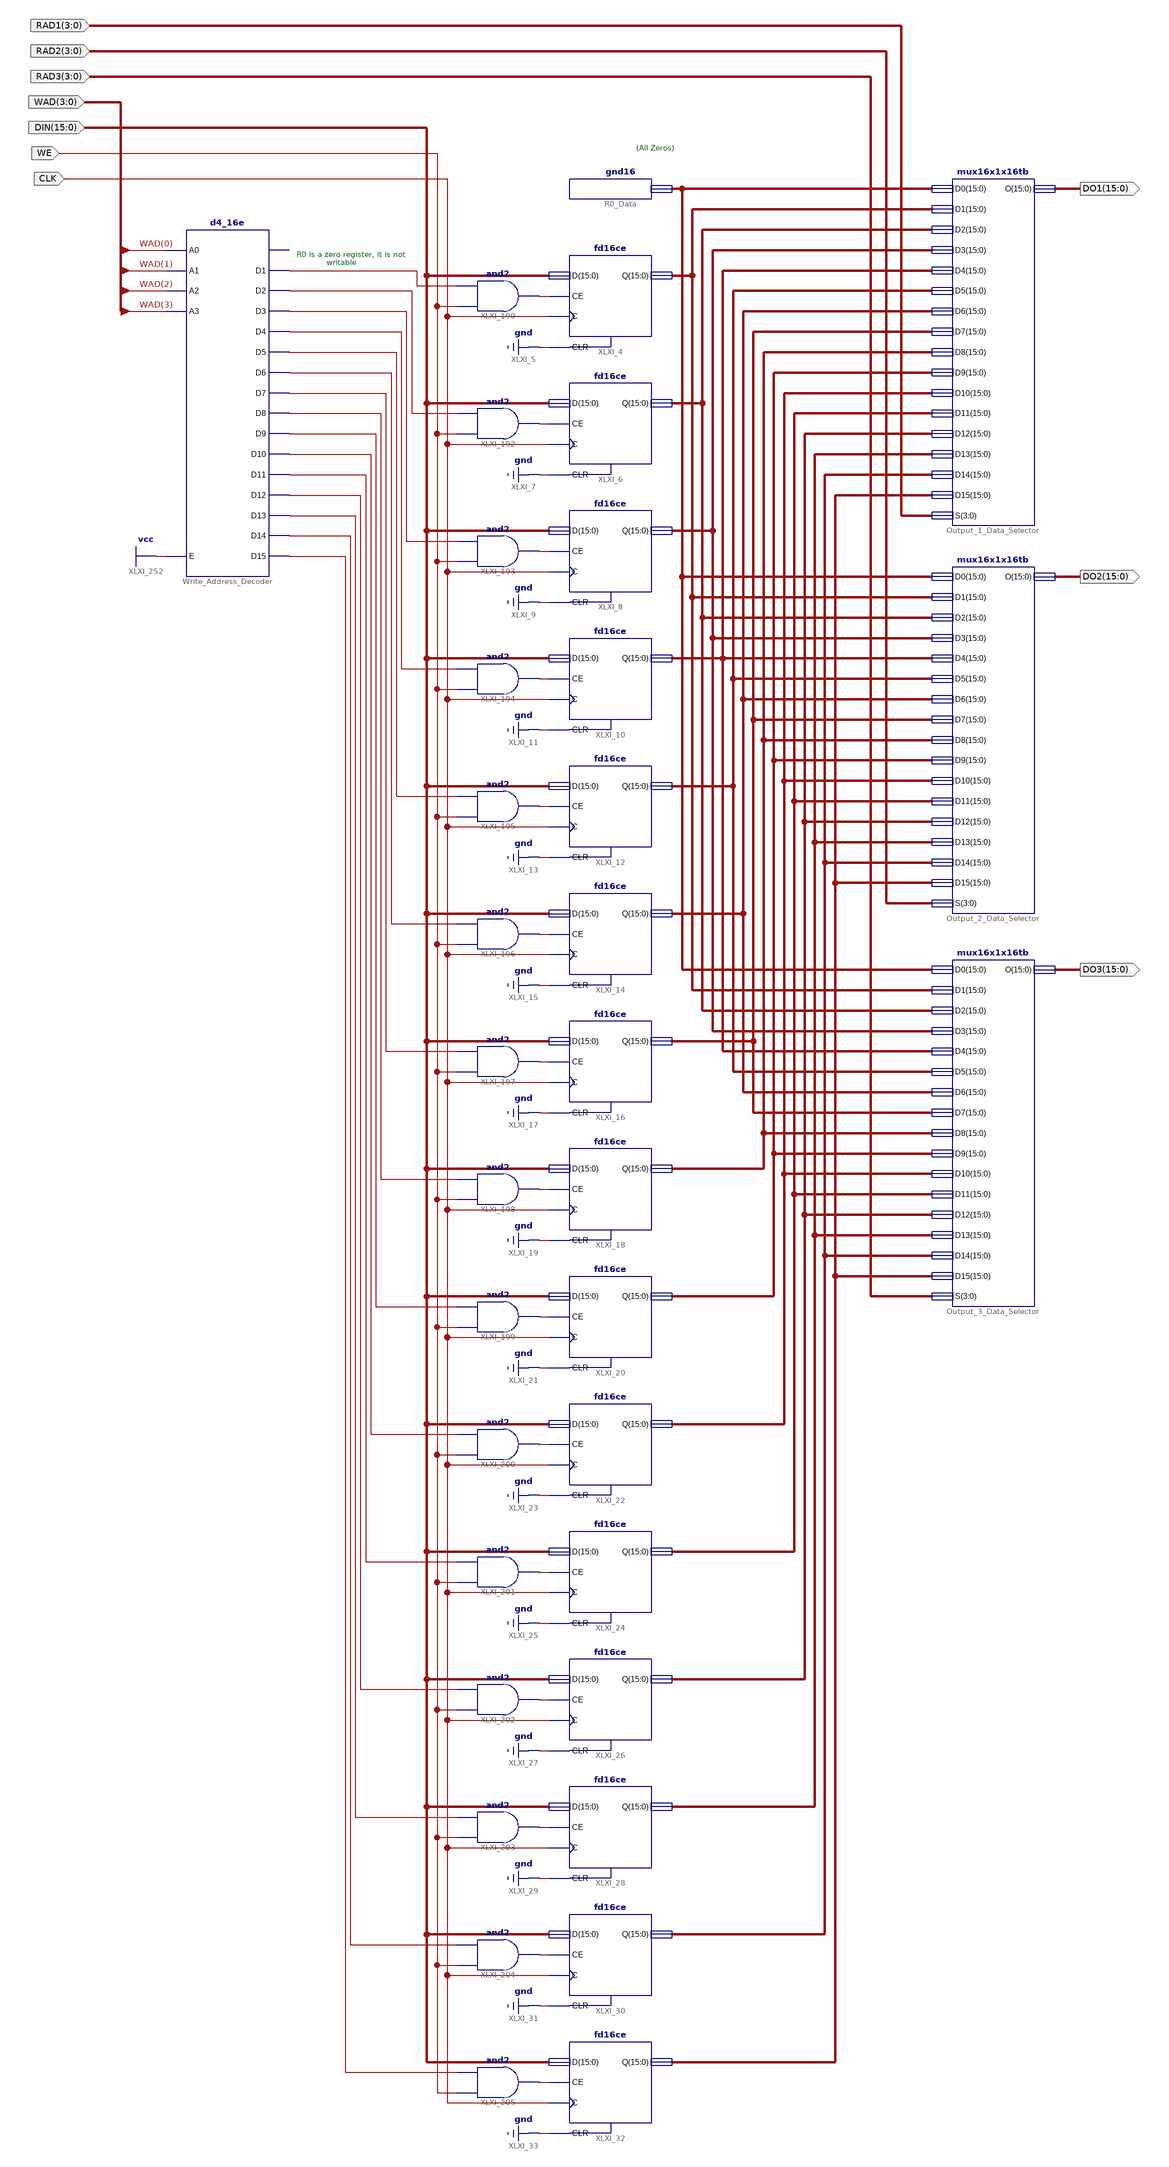
[diagram p0: schematic sheet 1]
// Xilinx ISE schematic regs.sch (spartan6) as structural Verilog: 35 symbols, 10 ports
module regs (
  input  [15:0] DIN,
  input  [3:0] WAD,
  input  WE,
  input  CLK,
  input  [3:0] RAD2,
  input  [3:0] RAD1,
  input  [3:0] RAD3,
  output [15:0] DO1,
  output [15:0] DO2,
  output [15:0] DO3
);

  wire XLXN_132, XLXN_135, XLXN_136, XLXN_137, XLXN_138, XLXN_139, XLXN_140, XLXN_141, XLXN_142, XLXN_143,
       XLXN_144, XLXN_145, XLXN_146, XLXN_147, XLXN_148, XLXN_230, XLXN_231, XLXN_232, XLXN_233, XLXN_234,
       XLXN_235, XLXN_236, XLXN_237, XLXN_238, XLXN_239, XLXN_240, XLXN_241, XLXN_242, XLXN_243, XLXN_244;
  wire [15:0] XLXN_471, XLXN_472, XLXN_473, XLXN_475, XLXN_476, XLXN_478, XLXN_479, XLXN_494, XLXN_606,
       XLXN_607, XLXN_608, XLXN_609, XLXN_610, XLXN_611, XLXN_618, XLXN_619;

  d4_16e Write_Address_Decoder (
    .A0(WAD[0]), .A1(WAD[1]), .A2(WAD[2]), .A3(WAD[3]), .E(1'b1), .D1(XLXN_230), .D10(XLXN_239),
    .D11(XLXN_240), .D12(XLXN_241), .D13(XLXN_242), .D14(XLXN_243), .D15(XLXN_244), .D2(XLXN_231),
    .D3(XLXN_232), .D4(XLXN_233), .D5(XLXN_234), .D6(XLXN_235), .D7(XLXN_236), .D8(XLXN_237), .D9(XLXN_238));  // open: D0
  fd16ce XLXI_4 (.C(CLK), .CE(XLXN_132), .CLR(1'b0), .D(DIN), .Q(XLXN_607));
  fd16ce XLXI_6 (.C(CLK), .CE(XLXN_135), .CLR(1'b0), .D(DIN), .Q(XLXN_608));
  fd16ce XLXI_8 (.C(CLK), .CE(XLXN_136), .CLR(1'b0), .D(DIN), .Q(XLXN_609));
  fd16ce XLXI_10 (.C(CLK), .CE(XLXN_137), .CLR(1'b0), .D(DIN), .Q(XLXN_610));
  fd16ce XLXI_12 (.C(CLK), .CE(XLXN_138), .CLR(1'b0), .D(DIN), .Q(XLXN_611));
  fd16ce XLXI_14 (.C(CLK), .CE(XLXN_139), .CLR(1'b0), .D(DIN), .Q(XLXN_618));
  fd16ce XLXI_16 (.C(CLK), .CE(XLXN_140), .CLR(1'b0), .D(DIN), .Q(XLXN_619));
  fd16ce XLXI_18 (.C(CLK), .CE(XLXN_141), .CLR(1'b0), .D(DIN), .Q(XLXN_471));
  fd16ce XLXI_20 (.C(CLK), .CE(XLXN_142), .CLR(1'b0), .D(DIN), .Q(XLXN_472));
  fd16ce XLXI_22 (.C(CLK), .CE(XLXN_143), .CLR(1'b0), .D(DIN), .Q(XLXN_473));
  fd16ce XLXI_24 (.C(CLK), .CE(XLXN_144), .CLR(1'b0), .D(DIN), .Q(XLXN_475));
  fd16ce XLXI_26 (.C(CLK), .CE(XLXN_145), .CLR(1'b0), .D(DIN), .Q(XLXN_476));
  fd16ce XLXI_28 (.C(CLK), .CE(XLXN_146), .CLR(1'b0), .D(DIN), .Q(XLXN_494));
  fd16ce XLXI_30 (.C(CLK), .CE(XLXN_147), .CLR(1'b0), .D(DIN), .Q(XLXN_478));
  fd16ce XLXI_32 (.C(CLK), .CE(XLXN_148), .CLR(1'b0), .D(DIN), .Q(XLXN_479));
  and XLXI_190 (XLXN_132, WE, XLXN_230);
  and XLXI_192 (XLXN_135, WE, XLXN_231);
  and XLXI_193 (XLXN_136, WE, XLXN_232);
  and XLXI_194 (XLXN_137, WE, XLXN_233);
  and XLXI_195 (XLXN_138, WE, XLXN_234);
  and XLXI_196 (XLXN_139, WE, XLXN_235);
  and XLXI_197 (XLXN_140, WE, XLXN_236);
  and XLXI_198 (XLXN_141, WE, XLXN_237);
  and XLXI_199 (XLXN_142, WE, XLXN_238);
  and XLXI_200 (XLXN_143, WE, XLXN_239);
  and XLXI_201 (XLXN_144, WE, XLXN_240);
  and XLXI_202 (XLXN_145, WE, XLXN_241);
  and XLXI_203 (XLXN_146, WE, XLXN_242);
  and XLXI_204 (XLXN_147, WE, XLXN_243);
  and XLXI_205 (XLXN_148, WE, XLXN_244);
  gnd16 R0_Data (.GNDO(XLXN_606));
  mux16x1x16tb Output_1_Data_Selector (
    .D0(XLXN_606), .D1(XLXN_607), .D10(XLXN_473), .D11(XLXN_475), .D12(XLXN_476), .D13(XLXN_494),
    .D14(XLXN_478), .D15(XLXN_479), .D2(XLXN_608), .D3(XLXN_609), .D4(XLXN_610), .D5(XLXN_611),
    .D6(XLXN_618), .D7(XLXN_619), .D8(XLXN_471), .D9(XLXN_472), .O(DO1), .S(RAD1));
  mux16x1x16tb Output_2_Data_Selector (
    .D0(XLXN_606), .D1(XLXN_607), .D10(XLXN_473), .D11(XLXN_475), .D12(XLXN_476), .D13(XLXN_494),
    .D14(XLXN_478), .D15(XLXN_479), .D2(XLXN_608), .D3(XLXN_609), .D4(XLXN_610), .D5(XLXN_611),
    .D6(XLXN_618), .D7(XLXN_619), .D8(XLXN_471), .D9(XLXN_472), .O(DO2), .S(RAD2));
  mux16x1x16tb Output_3_Data_Selector (
    .D0(XLXN_606), .D1(XLXN_607), .D10(XLXN_473), .D11(XLXN_475), .D12(XLXN_476), .D13(XLXN_494),
    .D14(XLXN_478), .D15(XLXN_479), .D2(XLXN_608), .D3(XLXN_609), .D4(XLXN_610), .D5(XLXN_611),
    .D6(XLXN_618), .D7(XLXN_619), .D8(XLXN_471), .D9(XLXN_472), .O(DO3), .S(RAD3));

  // Notes on the sheet:
  //   (All Zeros)
  //   R0 is a zero register, it is not  
  //               writable
endmodule
